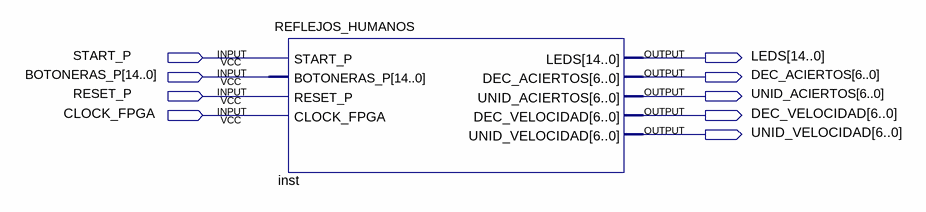
[diagram p0: schematic sheet]
// Quartus schematic BLOQUE_REFLEJOS_HUMANOS.bdf as structural Verilog: 1 symbols, 9 pins
module BLOQUE_REFLEJOS_HUMANOS (
  input  START_P,
  input  [14:0] BOTONERAS_P,
  input  RESET_P,
  input  CLOCK_FPGA,
  output [14:0] LEDS,
  output [6:0] DEC_ACIERTOS,
  output [6:0] UNID_ACIERTOS,
  output [6:0] DEC_VELOCIDAD,
  output [6:0] UNID_VELOCIDAD
);

  REFLEJOS_HUMANOS inst (
    .START_P(START_P), .BOTONERAS_P(BOTONERAS_P), .RESET_P(RESET_P), .CLOCK_FPGA(CLOCK_FPGA), .LEDS(LEDS),
    .DEC_ACIERTOS(DEC_ACIERTOS), .UNID_ACIERTOS(UNID_ACIERTOS), .DEC_VELOCIDAD(DEC_VELOCIDAD),
    .UNID_VELOCIDAD(UNID_VELOCIDAD));
endmodule
